# Altium project AWES Schematic.PrjPcb
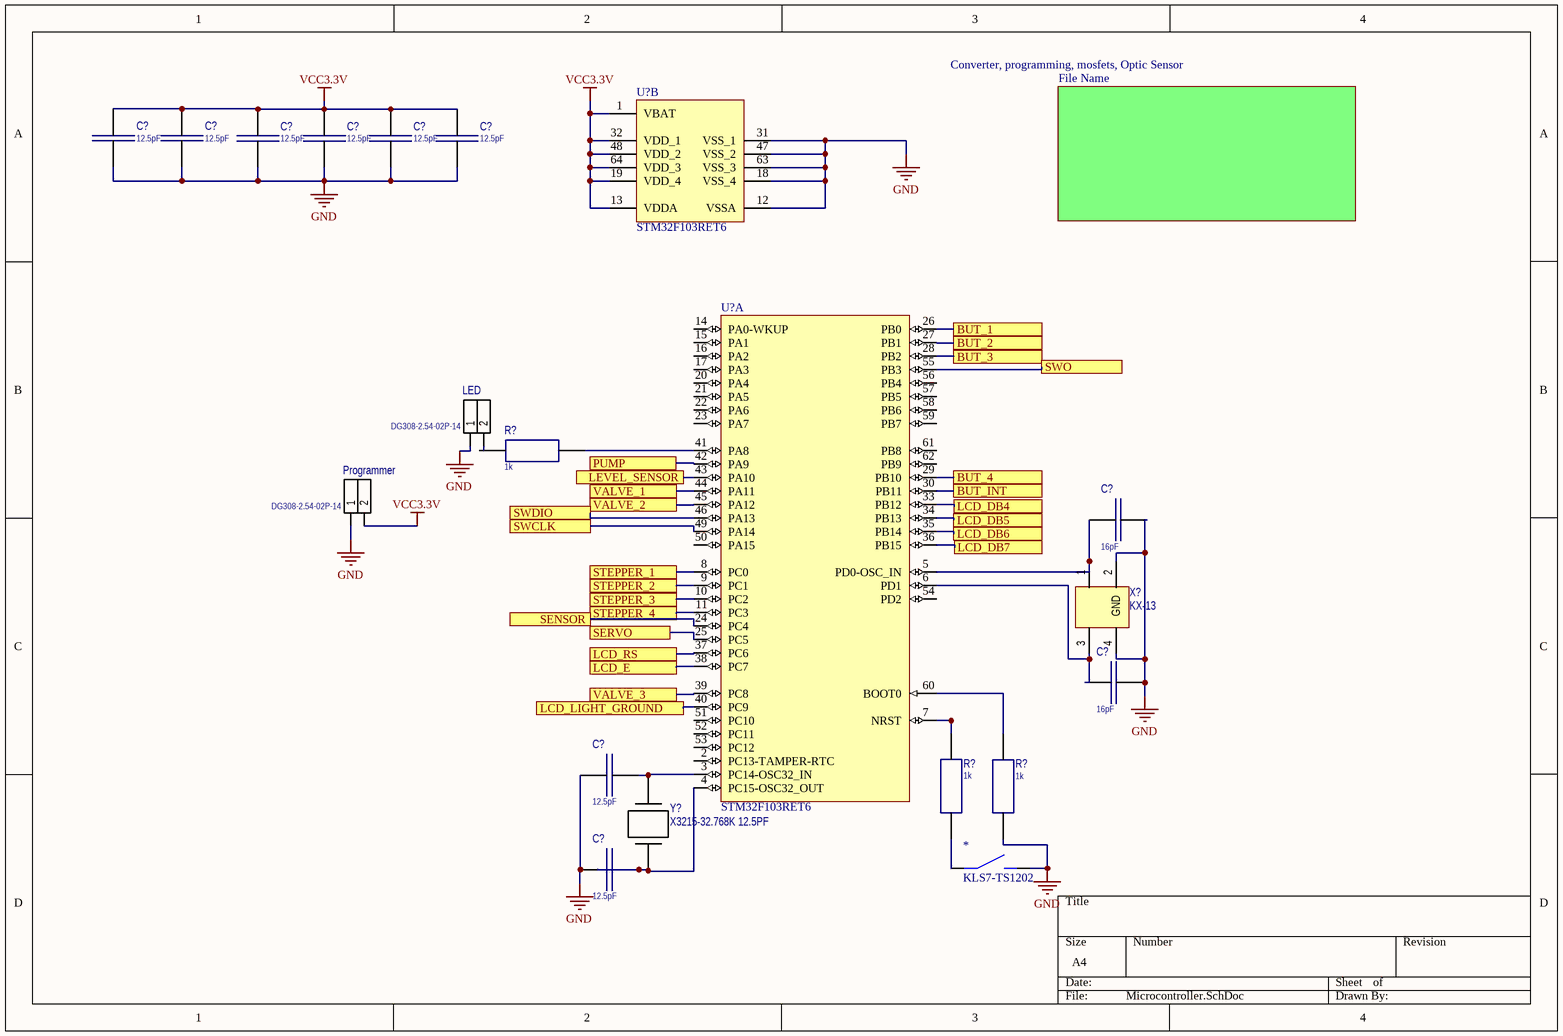
[diagram p0: Microcontroller.SchDoc]
8 sheets, 81 parts. Net scope: flat (ports and power ports of the same name join across sheets).
Sheets:
  Microcontroller.SchDoc
  Buttons.SchDoc
  LCD.SchDoc
  Pump.SchDoc
  Sensors.SchDoc
  Valve.SchDoc
  Converter.SchDoc
  Step Motor driver and Step Motor.SchDoc

## Sheet Microcontroller.SchDoc
size A4

### Parts
(Parts that share a designator on the sheet are numbered #1, #2 ... from top to bottom, then left to right.)
*#1  KLS7-TS1202  [KLS7-TS1202]
C?#1  12.5pF  [C_0805]
C?#2  12.5pF  [C_0805]
C?#3  12.5pF  [C_0805]
C?#4  12.5pF  [C_0805]
C?#5  12.5pF  [C_0805]
C?#6  12.5pF  [C_0805]
C?#7  16pF  [C_0805]
C?#8  16pF  [C_0805]
C?#9  12.5pF  [C_0805]
C?#10  12.5pF  [C_0805]
LED  DG308-2.54-02P-14  [DG308-2.54-02P-14]
Programmer  DG308-2.54-02P-14  [DG308-2.54-02P-14]
R?#1  1k  [R_0805]
R?#2  1k  [R_0805]
R?#3  1k  [R_0805]
U?#1  STM32F103RET6  [LQFP64_N]  (part B of 2)
U?#2  STM32F103RET6  [LQFP64_N]  (part A of 2)
X?#1  KX-13  [KX - 13]
Y?  X3215-32.768K 12.5PF  [x3215]

### Sub-sheets
Converter, programming, mosfets, Optic Sensor = File Name (file not in this document): no entries

### Ports
BUT_1, BUT_2, BUT_3, BUT_4, BUT_INT, LCD_DB4, LCD_DB5, LCD_DB6, LCD_DB7, LCD_E, LCD_LIGHT_GROUND, LCD_RS, LEVEL_SENSOR, PUMP, SENSOR, SERVO, STEPPER_1, STEPPER_2, STEPPER_3, STEPPER_4, SWCLK, SWDIO, SWO, VALVE_1, VALVE_2, VALVE_3

### Nets
GND: *#1.2 C?#1.2 C?#2.2 C?#3.2 C?#4.2 C?#5.2 C?#6.2 C?#7.1 C?#8.1 C?#9.2 C?#10.2 LED.1 Programmer.1 R?#3.2 U?#1.12(VSSA) U?#1.18(VSS_4) U?#1.31(VSS_1) U?#1.47(VSS_2) U?#1.63(VSS_3) X?#1.2(GND) X?#1.4
VCC3.3V: C?#1.1 C?#2.1 C?#3.1 C?#4.1 C?#5.1 C?#6.1 Programmer.2 U?#1.1(VBAT) U?#1.13(VDDA) U?#1.19(VDD_4) U?#1.32(VDD_1) U?#1.48(VDD_2) U?#1.64(VDD_3)
Net*#1_1: *#1.1 R?#2.2
NetC?#7_2: C?#7.2 U?#2.5(PD0-OSC_IN) X?#1.1
NetC?#8_2: C?#8.2 U?#2.6(PD1) X?#1.3
NetC?#9_1: C?#9.1 U?#2.3(PC14-OSC32_IN) Y?.1(OSC2)
NetC?#10_1: C?#10.1 U?#2.4(PC15-OSC32_OUT) Y?.0(OSC1)
NetC?#15_2: U?#2.43(PA10) ; port LEVEL_SENSOR
NetDS?_4: U?#2.37(PC6) ; port LCD_RS
NetDS?_6: U?#2.38(PC7) ; port LCD_E
NetDS?_11: U?#2.33(PB12) ; port LCD_DB4
NetDS?_12: U?#2.34(PB13) ; port LCD_DB5
NetDS?_13: U?#2.35(PB14) ; port LCD_DB6
NetDS?_14: U?#2.36(PB15) ; port LCD_DB7
NetR?#1_2: R?#1.2 U?#2.41(PA8)
NetR?#2_1: R?#2.1 U?#2.7(NRST)
NetR?#3_1: R?#3.1 U?#2.60(BOOT0)
NetR?#4_1: U?#2.30(PB11) ; port BUT_INT
NetR?#5_1: U?#2.29(PB10) ; port BUT_4
NetR?#6_1: U?#2.28(PB2) ; port BUT_3
NetR?#7_1: U?#2.27(PB1) ; port BUT_2
NetR?#8_1: U?#2.26(PB0) ; port BUT_1
NetR?#9_2: U?#2.40(PC9) ; port LCD_LIGHT_GROUND
NetR?#11_2: U?#2.42(PA9) ; port PUMP
NetR?#14_2: U?#2.44(PA11) ; port VALVE_1
NetR?#16_2: U?#2.45(PA12) ; port VALVE_2
NetR?#18_2: U?#2.39(PC8) ; port VALVE_3
NetU?#2_8: U?#2.8(PC0) ; port STEPPER_1
NetU?#2_9: U?#2.9(PC1) ; port STEPPER_2
NetU?#2_10: U?#2.10(PC2) ; port STEPPER_3
NetU?#2_11: U?#2.11(PC3) ; port STEPPER_4
NetU?#2_24: U?#2.24(PC4) ; port SENSOR
NetU?#2_25: U?#2.25(PC5) ; port SERVO
NetU?#2_46: U?#2.46(PA13) ; port SWDIO
NetU?#2_49: U?#2.49(PA14) ; port SWCLK
NetU?#2_55: U?#2.55(PB3) ; port SWO

Not connected (* = marked no-connect by the designer): LED 2; R?#1 1; U?#2 2(PC13-TAMPER-RTC) 14(PA0-WKUP) 15(PA1) 16(PA2) 17(PA3) 20(PA4) 21(PA5) 22(PA6) 23(PA7) 50(PA15) 51(PC10) 52(PC11) 53(PC12) 54(PD2) 56(PB4) 57(PB5) 58(PB6) 59(PB7) 61(PB8) 62(PB9)

### Library data of the parts
*#1 = KLS7-TS1202: Button
C?#1-C?#10 = C0805: Capacitor
  C?#1-C?#6 C?#9 C?#10: Value: 12.5pF
  C?#7 C?#8: Value: 16pF
LED Programmer = DG308-2.54-02P-14: Connector 3Pin 2.54 pitch
R?#1-R?#3 = R0805: Resistor; Value: 1k
U?#1 U?#2 = STM32F103RET6: STM32 ARM-based 32-bit MCU Performance Line with 512 kB Flash, 64 kB Internal RAM, -40 to +85°C Temperature, 64-Pin LQFP, Tray; DatasheetVersion: rev8.0, Apr-2011; PackageVersion: rev13, Apr-2011; PackageReference: LQFP64; PackageDescription: 64-Pin Low-Profile Quad Flat Pack, 10 x 10 mm Body, 0.5 mm Pitch (LQFP64); ComponentLink1Description: Manufacturer URL; ComponentLink1URL: http://www.st.com/; ComponentLink2Description: STM32F103 Datasheet; ComponentLink2URL: http://www.st.com/internet/com/TECHNICAL_RESOURCES/TECHNICAL_LITERATURE/DATASHEET/CD00191185.pdf; ComponentLink3Description: STM32 Family Web Page; ComponentLink3URL: www.st.com/stm32
X?#1 = KX-13: Quartz
Y? = Y_3215: Crystal Oscillator; Value: X3215-32.768K 12.5PF

## Sheet Buttons.SchDoc
size A4
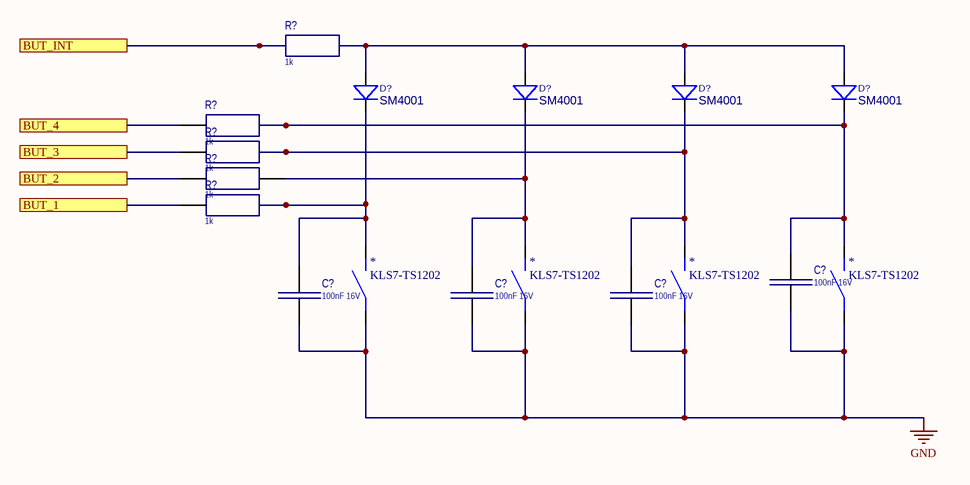
[diagram p1: Buttons.SchDoc]

### Parts
(Parts that share a designator on the sheet are numbered #1, #2 ... from top to bottom, then left to right.)
*#2  KLS7-TS1202  [KLS7-TS1202]
*#3  KLS7-TS1202  [KLS7-TS1202]
*#4  KLS7-TS1202  [KLS7-TS1202]
*#5  KLS7-TS1202  [KLS7-TS1202]
C?#11  100nF 16V  [C_0603]
C?#12  100nF 16V  [C_0603]
C?#13  100nF 16V  [C_0603]
C?#14  100nF 16V  [C_0603]
D?#1  SM4001  [DIODE_DO-213AB]
D?#2  SM4001  [DIODE_DO-213AB]
D?#3  SM4001  [DIODE_DO-213AB]
D?#4  SM4001  [DIODE_DO-213AB]
R?#4  1k  [R_0805]
R?#5  1k  [R_0805]
R?#6  1k  [R_0805]
R?#7  1k  [R_0805]
R?#8  1k  [R_0805]

### Ports
BUT_1, BUT_2, BUT_3, BUT_4, BUT_INT

### Nets
GND: *#2.1 *#3.1 *#4.1 *#5.1 C?#11.1 C?#12.1 C?#13.1 C?#14.1
Net*#2_2: *#2.2 C?#12.2 D?#1.2(K) R?#8.2
Net*#3_2: *#3.2 C?#13.2 D?#2.2(K) R?#7.2
Net*#4_2: *#4.2 C?#14.2 D?#3.2(K) R?#6.2
Net*#5_2: *#5.2 C?#11.2 D?#4.2(K) R?#5.2
NetD?#1_1: D?#1.1(A) D?#2.1(A) D?#3.1(A) D?#4.1(A) R?#4.2
NetR?#4_1: R?#4.1 ; port BUT_INT
NetR?#5_1: R?#5.1 ; port BUT_4
NetR?#6_1: R?#6.1 ; port BUT_3
NetR?#7_1: R?#7.1 ; port BUT_2
NetR?#8_1: R?#8.1 ; port BUT_1

### Library data of the parts
*#2-*#5 = KLS7-TS1202: Button
C?#11-C?#14 = C0603: Capacitor; Value: 100nF 16V
D?#1-D?#4 = D_DO-213: Diode
R?#4-R?#8 = R0805: Resistor; Value: 1k

## Sheet LCD.SchDoc
size A4
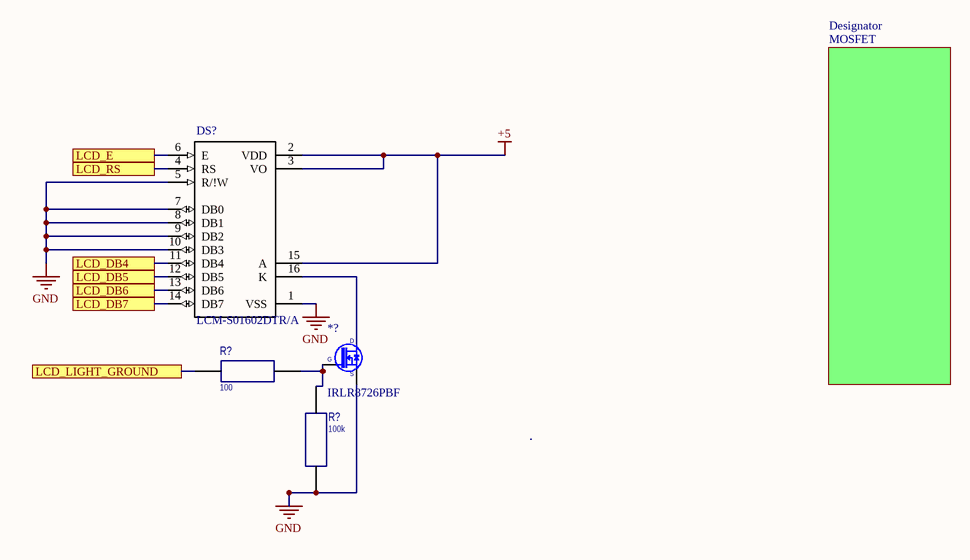
[diagram p2: LCD.SchDoc]

### Parts
(Parts that share a designator on the sheet are numbered #1, #2 ... from top to bottom, then left to right.)
*?#1  IRLR8726PBF  [IRLR8726PBF]
DS?  LCM-S01602DTR/A  [*LCD_LCM-S01602DTR/A]
R?#9  100  [R_0805]
R?#10  100k  [R_0805]

### Sub-sheets
Designator = MOSFET (file not in this document): no entries

### Ports
LCD_DB4, LCD_DB5, LCD_DB6, LCD_DB7, LCD_E, LCD_LIGHT_GROUND, LCD_RS

### Nets
+5: DS?.2(VDD) DS?.3(VO) DS?.15(A)
GND: *?#1.3(S) DS?.1(VSS) DS?.5(R/!W) DS?.7(DB0) DS?.8(DB1) DS?.9(DB2) DS?.10(DB3) R?#10.1
Net*?#1_2: *?#1.2(G) R?#9.1 R?#10.2
NetDS?_4: DS?.4(RS) ; port LCD_RS
NetDS?_6: DS?.6(E) ; port LCD_E
NetDS?_11: DS?.11(DB4) ; port LCD_DB4
NetDS?_12: DS?.12(DB5) ; port LCD_DB5
NetDS?_13: DS?.13(DB6) ; port LCD_DB6
NetDS?_14: DS?.14(DB7) ; port LCD_DB7
NetR?#9_2: R?#9.2 ; port LCD_LIGHT_GROUND

Not connected (* = marked no-connect by the designer): DS? 16(K)

### Notes on the sheet
- (in symbol IRLR8726PBF) D

### Library data of the parts
DS? = LCM-S01602DTR/A: Module, LCD; 16 x 2 mm; 5 x 8; 5 V _Typ._; 2 mA _Typ._; 4.2 V @50 degC _Min._; MF: Lumex Opto/Components; SnapEDA_Link: https://www.snapeda.com/parts/LCM-S01602DTR/A/Lumex%20Opto/Components%20Inc./view-part/?ref=snap; Availability: Unavailable; Package: None; Price: None; MP: LCM-S01602DTR/A; Value: *
R?#9 R?#10 = R0805: Resistor
  R?#9: Value: 100
  R?#10: Value: 100k

## Sheet Pump.SchDoc
size A4
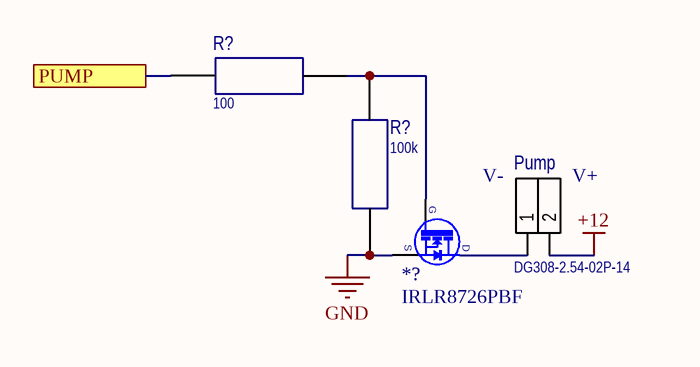
[diagram p3: Pump.SchDoc]

### Parts
(Parts that share a designator on the sheet are numbered #1, #2 ... from top to bottom, then left to right.)
*?#2  IRLR8726PBF  [IRLR8726PBF]
Pump  DG308-2.54-02P-14  [DG308-2.54-02P-14]
R?#11  100  [R_0805]
R?#12  100k  [R_0805]

### Ports
PUMP

### Nets
+12: Pump.2
GND: *?#2.3(S) R?#12.1
Net*?#2_2: *?#2.2(G) R?#11.1 R?#12.2
NetR?#11_2: R?#11.2 ; port PUMP

Not connected (* = marked no-connect by the designer): Pump 1

### Notes on the sheet
- V-
- (near Pump) V+
- (in symbol IRLR8726PBF) D

### Library data of the parts
Pump = DG308-2.54-02P-14: Connector 3Pin 2.54 pitch
R?#11 R?#12 = R0805: Resistor
  R?#11: Value: 100
  R?#12: Value: 100k

## Sheet Sensors.SchDoc
size A4
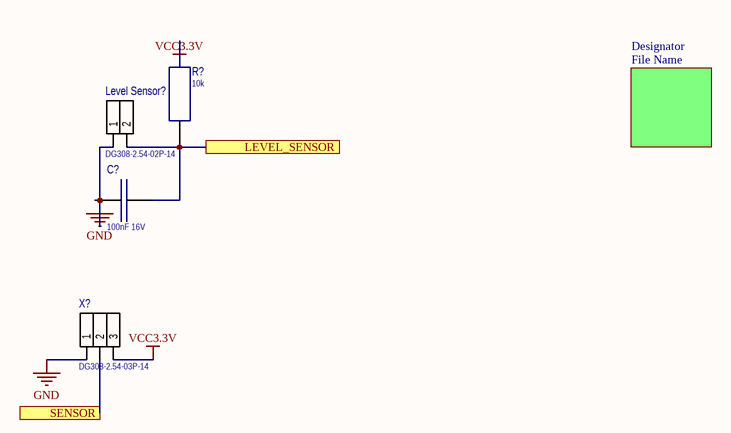
[diagram p4: Sensors.SchDoc]

### Parts
(Parts that share a designator on the sheet are numbered #1, #2 ... from top to bottom, then left to right.)
C?#15  100nF 16V  [C_0805]
Level_Sensor?  DG308-2.54-02P-14  [DG308-2.54-02P-14]
R?#13  10k  [R_0805]
X?#2  DG308-2.54-03P-14  [DG308-2.54-03P-14]

### Sub-sheets
Designator = File Name (file not in this document): no entries

### Ports
LEVEL_SENSOR, SENSOR

### Nets
GND: C?#15.1 Level_Sensor?.1 X?#2.1
VCC3.3V: R?#13.2 X?#2.3
NetC?#15_2: C?#15.2 Level_Sensor?.2 R?#13.1 ; port LEVEL_SENSOR
NetU?#2_24: X?#2.2 ; port SENSOR

### Library data of the parts
C?#15 = C0805: Capacitor; Value: 100nF 16V
Level_Sensor? = DG308-2.54-02P-14: Connector 3Pin 2.54 pitch
R?#13 = R0805: Resistor; Value: 10k
X?#2 = DG308-2.54-03P-14: Connector 3Pin 2.54 pitch

## Sheet Valve.SchDoc
size A4
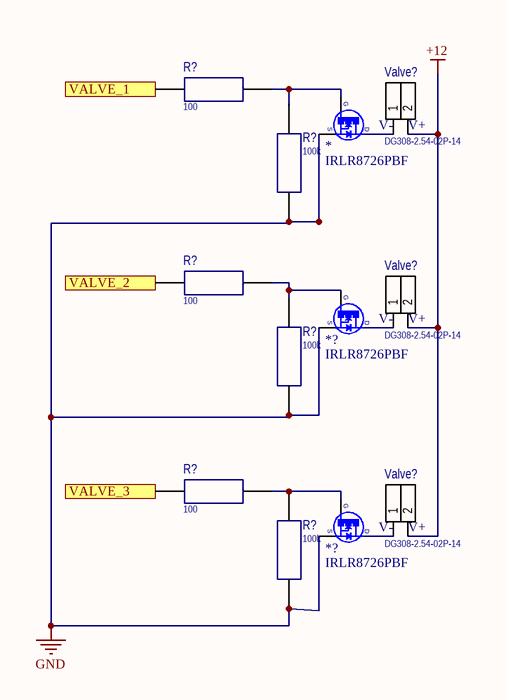
[diagram p5: Valve.SchDoc]

### Parts
(Parts that share a designator on the sheet are numbered #1, #2 ... from top to bottom, then left to right.)
*#6  IRLR8726PBF  [IRLR8726PBF]
*?#3  IRLR8726PBF  [IRLR8726PBF]
*?#4  IRLR8726PBF  [IRLR8726PBF]
R?#14  100  [R_0805]
R?#15  100k  [R_0805]
R?#16  100  [R_0805]
R?#17  100k  [R_0805]
R?#18  100  [R_0805]
R?#19  100k  [R_0805]
Valve?#1  DG308-2.54-02P-14  [DG308-2.54-02P-14]
Valve?#2  DG308-2.54-02P-14  [DG308-2.54-02P-14]
Valve?#3  DG308-2.54-02P-14  [DG308-2.54-02P-14]

### Ports
VALVE_1, VALVE_2, VALVE_3

### Nets
+12: Valve?#1.2 Valve?#2.2 Valve?#3.2
GND: *#6.3(S) *?#3.3(S) *?#4.3(S) R?#15.1 R?#17.1 R?#19.1
Net*#6_2: *#6.2(G) R?#14.1 R?#15.2
Net*?#3_2: *?#3.2(G) R?#16.1 R?#17.2
Net*?#4_2: *?#4.2(G) R?#18.1 R?#19.2
NetR?#14_2: R?#14.2 ; port VALVE_1
NetR?#16_2: R?#16.2 ; port VALVE_2
NetR?#18_2: R?#18.2 ; port VALVE_3

Not connected (* = marked no-connect by the designer): Valve?#1 1; Valve?#2 1; Valve?#3 1

### Notes on the sheet
- (near Valve?#1) V-
- (near Valve?#1) V+
- (near Valve?#2) V-
- (near Valve?#2) V+
- (near Valve?#3) V-
- (near Valve?#3) V+
- (in symbol IRLR8726PBF) D

### Library data of the parts
R?#14-R?#19 = R0805: Resistor
  R?#14 R?#16 R?#18: Value: 100
  R?#15 R?#17 R?#19: Value: 100k
Valve?#1-Valve?#3 = DG308-2.54-02P-14: Connector 3Pin 2.54 pitch

## Sheet Converter.SchDoc
size A4
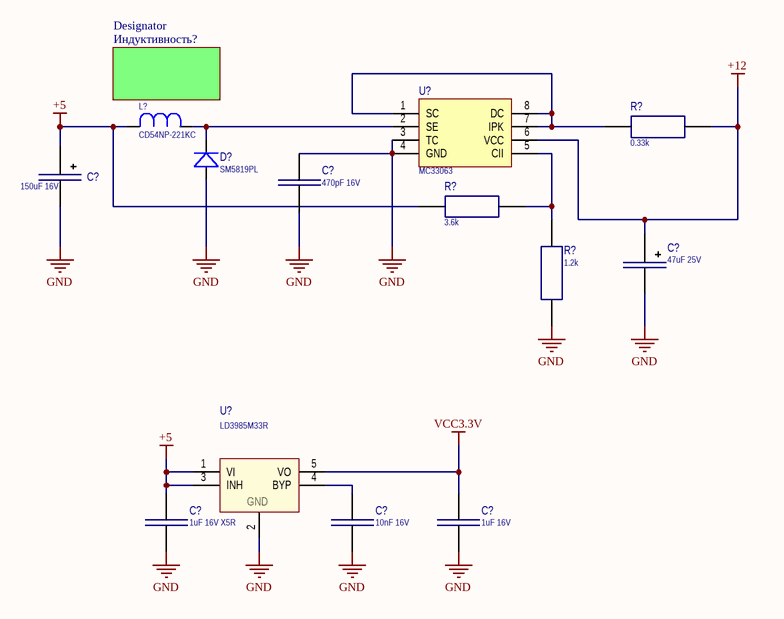
[diagram p6: Converter.SchDoc]

### Parts
(Parts that share a designator on the sheet are numbered #1, #2 ... from top to bottom, then left to right.)
C?#16  150uF 16V  [CPM7343]
C?#17  470pF 16V  [C_0805]
C?#18  47uF 25V  [CPM7343]
C?#19  1uF 16V X5R  [C_0603]
C?#20  10nF 16V  [C_0603]
C?#21  1uF 16V  [C_0603]
D?#5  SM5819PL  [SOD-123]
L?  CD54NP-221KC  [CD54NP]
R?#20  0.33k  [R_0805]
R?#21  3.6k  [R_0805]
R?#22  1.2k  [R_0805]
U?#3  MC33063  [SO-8]
U?#4  LD3985M33R  [SOT23-5]

### Sub-sheets
Designator = Индуктивность? (file not in this document): no entries

### Nets
+5: C?#16.1 C?#19.2 L?.2 R?#21.2 U?#4.1(VI) U?#4.3(INH)
+12: C?#18.1 R?#20.1 U?#3.6(VCC)
GND: C?#16.2 C?#17.1 C?#17.2 C?#18.2 C?#19.1 C?#20.1 C?#21.1 D?#5.1(A) R?#22.2 U?#3.3(TC) U?#3.4(GND) U?#4.2(GND)
VCC3.3V: C?#21.2 U?#4.5(VO)
NetC?#20_2: C?#20.2 U?#4.4(BYP)
NetD?#5_2: D?#5.2(K) L?.1 U?#3.2(SE)
NetR?#20_2: R?#20.2 U?#3.1(SC) U?#3.7(IPK) U?#3.8(DC)
NetR?#21_1: R?#21.1 R?#22.1 U?#3.5(CII)

### Library data of the parts
C?#16 = CPM7343: Capacitor; Value: 150uF 16V
C?#17 = C0805: Capacitor; Value: 470pF 16V
C?#18 = CPM7343H: Capacitor; Value: 47uF 25V
C?#19-C?#21 = C0603: Capacitor
  C?#19: Value: 1uF 16V X5R
  C?#20: Value: 10nF 16V
  C?#21: Value: 1uF 16V
D?#5 = D_SOD123: Diode
L? = L_CD54NP: Inductor; Value: CD54NP-221KC
R?#20-R?#22 = R0805: Resistor
  R?#20: Value: 0.33k
  R?#21: Value: 3.6k
  R?#22: Value: 1.2k
U?#3 = MC33063: Step-up/down IC

## Sheet Step Motor driver and Step Motor.SchDoc
size A4
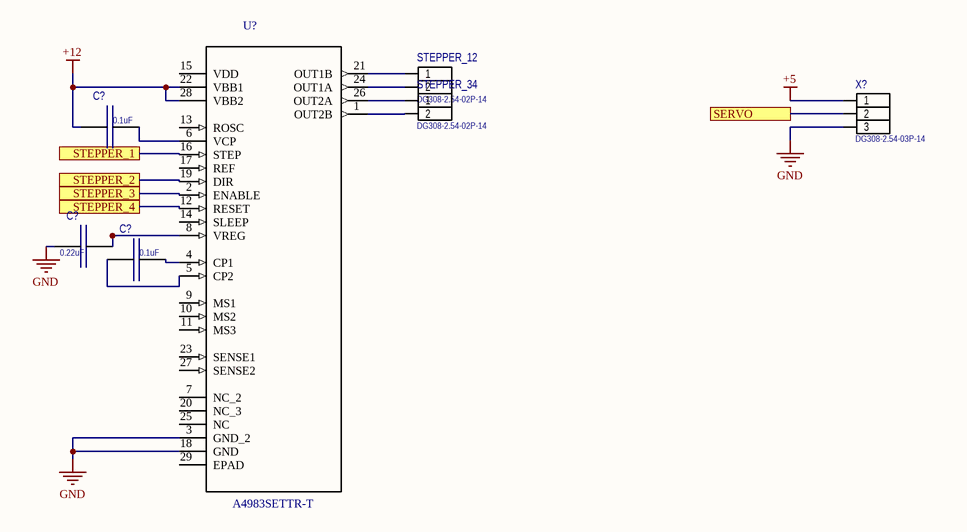
[diagram p7: Step Motor driver and Step Motor.SchDoc]

### Parts
(Parts that share a designator on the sheet are numbered #1, #2 ... from top to bottom, then left to right.)
C?#22  0.1uF  [C_0805]
C?#23  0.22uF  [C_0805]
C?#24  0.1uF  [C_0805]
STEPPER_12  DG308-2.54-02P-14  [DG308-2.54-02P-14]
STEPPER_34  DG308-2.54-02P-14  [DG308-2.54-02P-14]
U?#5  A4983SETTR-T  [*QFN50P500X500X100-29N]
X?#3  DG308-2.54-03P-14  [DG308-2.54-03P-14]

### Ports
SERVO, STEPPER_1, STEPPER_2, STEPPER_3, STEPPER_4

### Nets
+5: X?#3.1
+12: C?#22.1 U?#5.22(VBB1) U?#5.28(VBB2)
GND: C?#23.1 U?#5.3(GND_2) U?#5.18(GND) X?#3.3
NetC?#22_2: C?#22.2 U?#5.6(VCP)
NetC?#23_2: C?#23.2 U?#5.8(VREG)
NetC?#24_1: C?#24.1 U?#5.5(CP2)
NetC?#24_2: C?#24.2 U?#5.4(CP1)
NetSTEPPER_12_1: STEPPER_12.1 U?#5.21(OUT1B)
NetSTEPPER_12_2: STEPPER_12.2 U?#5.24(OUT1A)
NetSTEPPER_34_1: STEPPER_34.1 U?#5.26(OUT2A)
NetSTEPPER_34_2: STEPPER_34.2 U?#5.1(OUT2B)
NetU?#2_8: U?#5.16(STEP) ; port STEPPER_1
NetU?#2_9: U?#5.19(DIR) ; port STEPPER_2
NetU?#2_10: U?#5.2(ENABLE) ; port STEPPER_3
NetU?#2_11: U?#5.12(RESET) ; port STEPPER_4
NetU?#2_25: X?#3.2 ; port SERVO

Not connected (* = marked no-connect by the designer): U?#5 7(NC_2) 9(MS1) 10(MS2) 11(MS3) 13(ROSC) 14(SLEEP) 15(VDD) 17(REF) 20(NC_3) 23(SENSE1) 25(NC) 27(SENSE2) 29(EPAD)

### Library data of the parts
C?#22-C?#24 = C0805: Capacitor
  C?#22 C?#24: Value: 0.1uF
  C?#23: Value: 0.22uF
STEPPER_12 STEPPER_34 = DG308-2.54-02P-14: Connector 3Pin 2.54 pitch
U?#5 = A4983SETTR-T: DMOS Stepping Motor Driver 28-Pin QFN EP T/R; MF: Allegro MicroSystems LLC; Package: QFN-28 Allegro MicroSystems LLC; MP: A4983SETTR-T; SnapEDA_Link: https://www.snapeda.com/parts/A4983SETTR-T/Allegro%20MicroSystems%20LLC/view-part/?ref=snap; Availability: Unavailable; Price: None; Value: *
X?#3 = DG308-2.54-03P-14: Connector 3Pin 2.54 pitch

## Nets that join several sheets
+5: LCD (DS?.2 DS?.3 DS?.15), Converter (6 pins), Step Motor driver and Step Motor (X?#3.1)
+12: Pump (Pump.2), Valve (Valve?#1.2 Valve?#2.2 Valve?#3.2), Converter (C?#18.1 R?#20.1 U?#3.6), Step Motor driver and Step Motor (C?#22.1 U?#5.22 U?#5.28)
GND: Microcontroller (21 pins), Buttons (8 pins), LCD (8 pins), Pump (*?#2.3 R?#12.1), Sensors (C?#15.1 Level_Sensor?.1 X?#2.1), Valve (6 pins), Converter (12 pins), Step Motor driver and Step Motor (C?#23.1 U?#5.3 U?#5.18 X?#3.3)
VCC3.3V: Microcontroller (13 pins), Sensors (R?#13.2 X?#2.3), Converter (C?#21.2 U?#4.5)
NetC?#15_2: Microcontroller (U?#2.43), Sensors (C?#15.2 Level_Sensor?.2 R?#13.1)
NetDS?_4: Microcontroller (U?#2.37), LCD (DS?.4)
NetDS?_6: Microcontroller (U?#2.38), LCD (DS?.6)
NetDS?_11: Microcontroller (U?#2.33), LCD (DS?.11)
NetDS?_12: Microcontroller (U?#2.34), LCD (DS?.12)
NetDS?_13: Microcontroller (U?#2.35), LCD (DS?.13)
NetDS?_14: Microcontroller (U?#2.36), LCD (DS?.14)
NetR?#4_1: Microcontroller (U?#2.30), Buttons (R?#4.1)
NetR?#5_1: Microcontroller (U?#2.29), Buttons (R?#5.1)
NetR?#6_1: Microcontroller (U?#2.28), Buttons (R?#6.1)
NetR?#7_1: Microcontroller (U?#2.27), Buttons (R?#7.1)
NetR?#8_1: Microcontroller (U?#2.26), Buttons (R?#8.1)
NetR?#9_2: Microcontroller (U?#2.40), LCD (R?#9.2)
NetR?#11_2: Microcontroller (U?#2.42), Pump (R?#11.2)
NetR?#14_2: Microcontroller (U?#2.44), Valve (R?#14.2)
NetR?#16_2: Microcontroller (U?#2.45), Valve (R?#16.2)
NetR?#18_2: Microcontroller (U?#2.39), Valve (R?#18.2)
NetU?#2_8: Microcontroller (U?#2.8), Step Motor driver and Step Motor (U?#5.16)
NetU?#2_9: Microcontroller (U?#2.9), Step Motor driver and Step Motor (U?#5.19)
NetU?#2_10: Microcontroller (U?#2.10), Step Motor driver and Step Motor (U?#5.2)
NetU?#2_11: Microcontroller (U?#2.11), Step Motor driver and Step Motor (U?#5.12)
NetU?#2_24: Microcontroller (U?#2.24), Sensors (X?#2.2)
NetU?#2_25: Microcontroller (U?#2.25), Step Motor driver and Step Motor (X?#3.2)